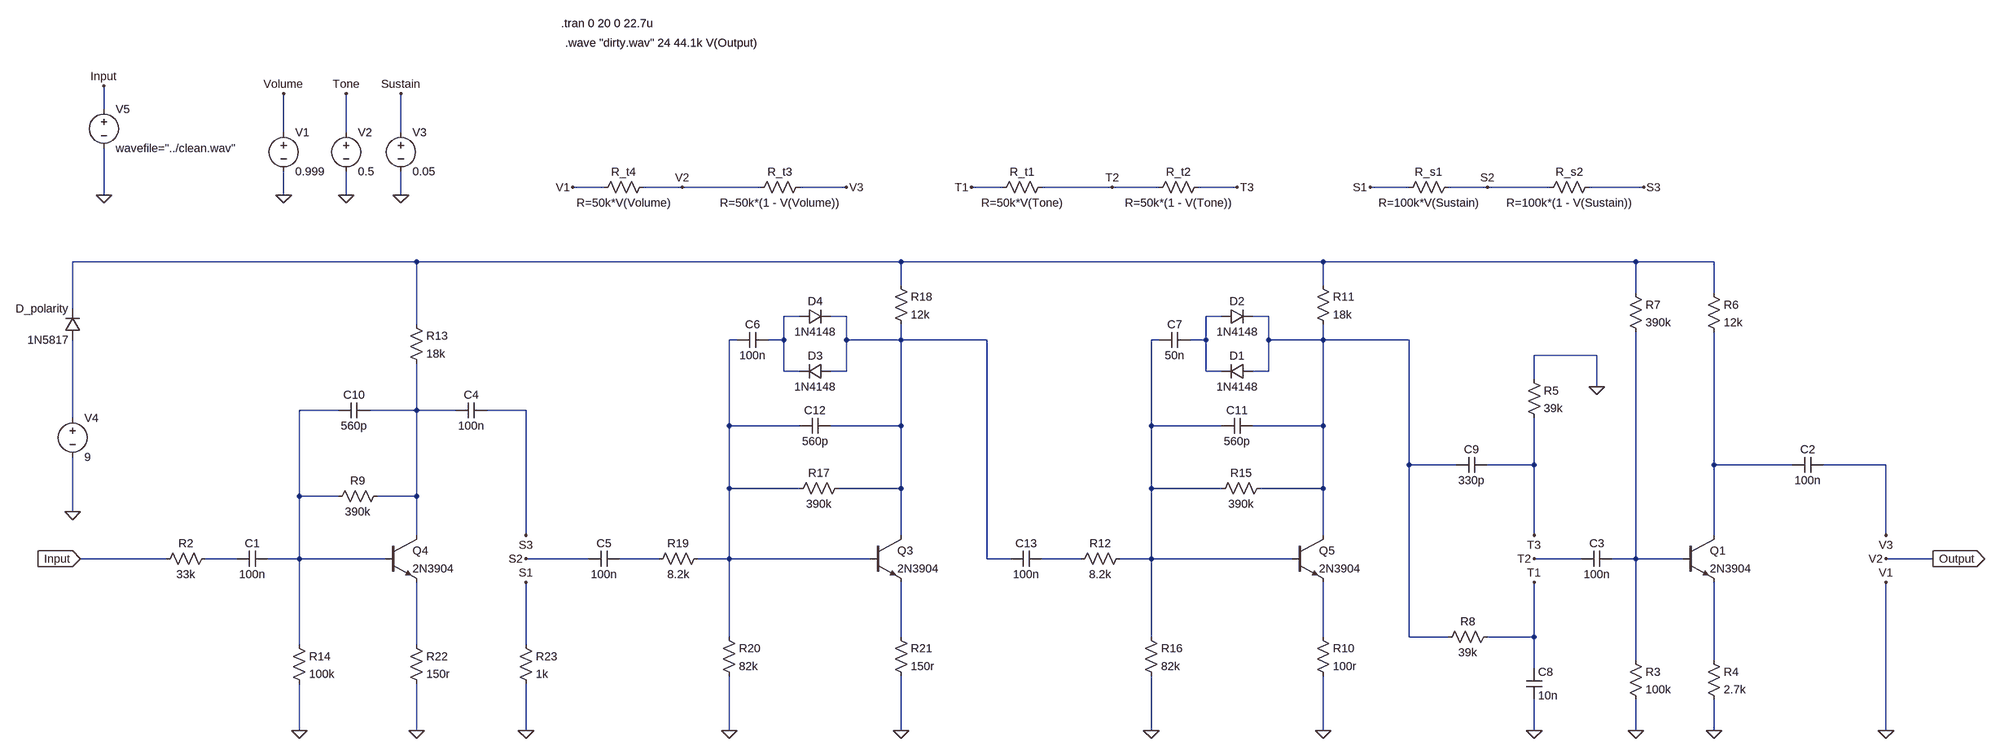
[diagram p0: schematic elk_sustainar.asc]
elk_sustainar.asc, the LTspice schematic file:
Version 4.1
SHEET 1 6764 4092
WIRE -464 -736 -464 -784
WIRE -96 -688 -96 -768
WIRE 32 -688 32 -768
WIRE 144 -688 144 -768
WIRE 560 -576 496 -576
WIRE 720 -576 640 -576
WIRE 880 -576 720 -576
WIRE 1056 -576 960 -576
WIRE 1376 -576 1312 -576
WIRE 1600 -576 1456 -576
WIRE 1696 -576 1600 -576
WIRE 1856 -576 1776 -576
WIRE 2208 -576 2128 -576
WIRE 2368 -576 2288 -576
WIRE 2496 -576 2368 -576
WIRE 2688 -576 2576 -576
WIRE -464 -560 -464 -656
WIRE -96 -560 -96 -608
WIRE 32 -560 32 -608
WIRE 144 -560 144 -608
WIRE 176 -400 -528 -400
WIRE 1168 -400 176 -400
WIRE 2032 -400 1168 -400
WIRE 2672 -400 2032 -400
WIRE 2832 -400 2672 -400
WIRE 1168 -352 1168 -400
WIRE 2032 -352 2032 -400
WIRE 2672 -336 2672 -400
WIRE 2832 -336 2832 -400
WIRE -528 -304 -528 -400
WIRE 960 -288 928 -288
WIRE 1056 -288 1024 -288
WIRE 1824 -288 1792 -288
WIRE 1920 -288 1888 -288
WIRE 176 -272 176 -400
WIRE 832 -240 816 -240
WIRE 928 -240 928 -288
WIRE 928 -240 896 -240
WIRE 1056 -240 1056 -288
WIRE 1168 -240 1168 -272
WIRE 1168 -240 1056 -240
WIRE 1344 -240 1168 -240
WIRE 1696 -240 1680 -240
WIRE 1792 -240 1792 -288
WIRE 1792 -240 1760 -240
WIRE 1920 -240 1920 -288
WIRE 2032 -240 2032 -272
WIRE 2032 -240 1920 -240
WIRE 2208 -240 2032 -240
WIRE 2592 -208 2464 -208
WIRE 928 -176 928 -240
WIRE 960 -176 928 -176
WIRE 1056 -176 1056 -240
WIRE 1056 -176 1024 -176
WIRE 1792 -176 1792 -240
WIRE 1824 -176 1792 -176
WIRE 1920 -176 1920 -240
WIRE 1920 -176 1888 -176
WIRE 2464 -160 2464 -208
WIRE 2592 -144 2592 -208
WIRE 16 -96 -64 -96
WIRE 176 -96 176 -192
WIRE 176 -96 80 -96
WIRE 256 -96 176 -96
WIRE 400 -96 320 -96
WIRE -528 -80 -528 -240
WIRE 816 -64 816 -240
WIRE 960 -64 816 -64
WIRE 1168 -64 1168 -240
WIRE 1168 -64 1024 -64
WIRE 1680 -64 1680 -240
WIRE 1824 -64 1680 -64
WIRE 2032 -64 2032 -240
WIRE 2032 -64 1888 -64
WIRE 2208 16 2208 -240
WIRE 2304 16 2208 16
WIRE 2464 16 2464 -80
WIRE 2464 16 2368 16
WIRE 2832 16 2832 -256
WIRE 2992 16 2832 16
WIRE 3184 16 3056 16
WIRE 816 64 816 -64
WIRE 960 64 816 64
WIRE 1168 64 1168 -64
WIRE 1168 64 1040 64
WIRE 1680 64 1680 -64
WIRE 1824 64 1680 64
WIRE 2032 64 2032 -64
WIRE 2032 64 1904 64
WIRE -64 80 -64 -96
WIRE 16 80 -64 80
WIRE 176 80 176 -96
WIRE 176 80 96 80
WIRE -528 112 -528 0
WIRE 176 160 176 80
WIRE 400 160 400 -96
WIRE 1168 160 1168 64
WIRE 2032 160 2032 64
WIRE 2464 160 2464 16
WIRE 2832 160 2832 16
WIRE 3184 160 3184 16
WIRE -336 208 -512 208
WIRE -192 208 -256 208
WIRE -64 208 -64 80
WIRE -64 208 -128 208
WIRE 112 208 -64 208
WIRE 528 208 400 208
WIRE 672 208 592 208
WIRE 816 208 816 64
WIRE 816 208 752 208
WIRE 1104 208 816 208
WIRE 1344 208 1344 -240
WIRE 1392 208 1344 208
WIRE 1536 208 1456 208
WIRE 1680 208 1680 64
WIRE 1680 208 1616 208
WIRE 1968 208 1680 208
WIRE 2560 208 2464 208
WIRE 2672 208 2672 -256
WIRE 2672 208 2624 208
WIRE 2768 208 2672 208
WIRE 3280 208 3184 208
WIRE 816 368 816 208
WIRE 1168 368 1168 256
WIRE 1680 368 1680 208
WIRE 2032 368 2032 256
WIRE 2208 368 2208 16
WIRE 2288 368 2208 368
WIRE 2464 368 2464 256
WIRE 2464 368 2368 368
WIRE -64 384 -64 208
WIRE 176 384 176 256
WIRE 400 384 400 256
WIRE 2672 416 2672 208
WIRE 2832 416 2832 256
WIRE 2464 432 2464 368
WIRE -64 560 -64 464
WIRE 176 560 176 464
WIRE 400 560 400 464
WIRE 816 560 816 448
WIRE 1168 560 1168 448
WIRE 1680 560 1680 448
WIRE 2032 560 2032 448
WIRE 2464 560 2464 496
WIRE 2672 560 2672 496
WIRE 2832 560 2832 496
WIRE 3184 560 3184 256
FLAG -96 -560 0
FLAG -96 -768 Volume
FLAG 32 -560 0
FLAG 32 -768 Tone
FLAG 144 -560 0
FLAG 144 -768 Sustain
FLAG -464 -784 Input
FLAG -464 -560 0
FLAG 1600 -576 T2
FLAG 2368 -576 S2
FLAG 2688 -576 S3
FLAG 2128 -576 S1
FLAG 1856 -576 T3
FLAG 1312 -576 T1
FLAG -528 112 0
FLAG -512 208 Input
IOPIN -512 208 In
FLAG 720 -576 V2
FLAG 1056 -576 V3
FLAG 496 -576 V1
FLAG -64 560 0
FLAG 176 560 0
FLAG 400 256 S1
FLAG 400 560 0
FLAG 400 160 S3
FLAG 400 208 S2
FLAG 816 560 0
FLAG 1168 560 0
FLAG 1680 560 0
FLAG 2032 560 0
FLAG 2464 560 0
FLAG 2592 -144 0
FLAG 2464 256 T1
FLAG 2464 160 T3
FLAG 2464 208 T2
FLAG 2672 560 0
FLAG 2832 560 0
FLAG 3184 256 V1
FLAG 3184 160 V3
FLAG 3184 208 V2
FLAG 3184 560 0
FLAG 3280 208 Output
IOPIN 3280 208 Out
SYMBOL voltage -96 -704 R0
WINDOW 123 0 0 Left 0
WINDOW 39 0 0 Left 0
SYMATTR InstName V1
SYMATTR Value 0.999
SYMBOL voltage 32 -704 R0
WINDOW 123 0 0 Left 0
WINDOW 39 0 0 Left 0
SYMATTR InstName V2
SYMATTR Value 0.5
SYMBOL voltage 144 -704 R0
WINDOW 123 0 0 Left 0
WINDOW 39 0 0 Left 0
SYMATTR InstName V3
SYMATTR Value 0.05
SYMBOL voltage -464 -752 R0
WINDOW 123 0 0 Left 0
WINDOW 39 0 0 Left 0
SYMATTR InstName V5
SYMATTR Value wavefile="../clean.wav"
SYMBOL res 1792 -592 R90
WINDOW 0 0 56 VBottom 2
WINDOW 3 32 56 VTop 2
SYMATTR InstName R_t2
SYMATTR Value R=50k*(1 - V(Tone))
SYMBOL res 1472 -592 R90
WINDOW 0 0 56 VBottom 2
WINDOW 3 32 56 VTop 2
SYMATTR InstName R_t1
SYMATTR Value R=50k*V(Tone)
SYMBOL res 2592 -592 R90
WINDOW 0 0 56 VBottom 2
WINDOW 3 32 56 VTop 2
SYMATTR InstName R_s2
SYMATTR Value R=100k*(1 - V(Sustain))
SYMBOL res 2304 -592 R90
WINDOW 0 0 56 VBottom 2
WINDOW 3 32 56 VTop 2
SYMATTR InstName R_s1
SYMATTR Value R=100k*V(Sustain)
SYMBOL voltage -528 -96 R0
WINDOW 123 0 0 Left 0
WINDOW 39 0 0 Left 0
SYMATTR InstName V4
SYMATTR Value 9
SYMBOL diode -512 -240 R180
WINDOW 0 24 64 Left 2
WINDOW 3 24 0 Left 2
SYMATTR InstName D_polarity
SYMATTR Value 1N5817
SYMBOL res -240 192 R90
WINDOW 0 0 56 VBottom 2
WINDOW 3 32 56 VTop 2
SYMATTR InstName R2
SYMATTR Value 33k
SYMBOL cap -128 192 R90
WINDOW 0 0 32 VBottom 2
WINDOW 3 32 32 VTop 2
SYMATTR InstName C1
SYMATTR Value 100n
SYMBOL res 976 -592 R90
WINDOW 0 0 56 VBottom 2
WINDOW 3 32 56 VTop 2
SYMATTR InstName R_t3
SYMATTR Value R=50k*(1 - V(Volume))
SYMBOL res 656 -592 R90
WINDOW 0 0 56 VBottom 2
WINDOW 3 32 56 VTop 2
SYMATTR InstName R_t4
SYMATTR Value R=50k*V(Volume)
SYMBOL npn 112 160 R0
SYMATTR InstName Q4
SYMATTR Value 2N3904
SYMBOL res -80 368 R0
SYMATTR InstName R14
SYMATTR Value 100k
SYMBOL res 160 368 R0
SYMATTR InstName R22
SYMATTR Value 150r
SYMBOL res 112 64 R90
WINDOW 0 0 56 VBottom 2
WINDOW 3 32 56 VTop 2
SYMATTR InstName R9
SYMATTR Value 390k
SYMBOL cap 80 -112 R90
WINDOW 0 0 32 VBottom 2
WINDOW 3 32 32 VTop 2
SYMATTR InstName C10
SYMATTR Value 560p
SYMBOL res 160 -288 R0
SYMATTR InstName R13
SYMATTR Value 18k
SYMBOL cap 320 -112 R90
WINDOW 0 0 32 VBottom 2
WINDOW 3 32 32 VTop 2
SYMATTR InstName C4
SYMATTR Value 100n
SYMBOL cap 592 192 R90
WINDOW 0 0 32 VBottom 2
WINDOW 3 32 32 VTop 2
SYMATTR InstName C5
SYMATTR Value 100n
SYMBOL res 384 368 R0
SYMATTR InstName R23
SYMATTR Value 1k
SYMBOL res 768 192 R90
WINDOW 0 0 56 VBottom 2
WINDOW 3 32 56 VTop 2
SYMATTR InstName R19
SYMATTR Value 8.2k
SYMBOL res 800 352 R0
SYMATTR InstName R20
SYMATTR Value 82k
SYMBOL npn 1104 160 R0
SYMATTR InstName Q3
SYMATTR Value 2N3904
SYMBOL res 1152 352 R0
SYMATTR InstName R21
SYMATTR Value 150r
SYMBOL res 1056 48 R90
WINDOW 0 0 56 VBottom 2
WINDOW 3 32 56 VTop 2
SYMATTR InstName R17
SYMATTR Value 390k
SYMBOL cap 1024 -80 R90
WINDOW 0 0 32 VBottom 2
WINDOW 3 32 32 VTop 2
SYMATTR InstName C12
SYMATTR Value 560p
SYMBOL cap 896 -256 R90
WINDOW 0 0 32 VBottom 2
WINDOW 3 32 32 VTop 2
SYMATTR InstName C6
SYMATTR Value 100n
SYMBOL diode 960 -304 M90
WINDOW 0 0 32 VBottom 2
WINDOW 3 32 32 VTop 2
SYMATTR InstName D4
SYMATTR Value 1N4148
SYMBOL diode 1024 -192 R90
WINDOW 0 0 32 VBottom 2
WINDOW 3 32 32 VTop 2
SYMATTR InstName D3
SYMATTR Value 1N4148
SYMBOL res 1152 -368 R0
SYMATTR InstName R18
SYMATTR Value 12k
SYMBOL cap 1456 192 R90
WINDOW 0 0 32 VBottom 2
WINDOW 3 32 32 VTop 2
SYMATTR InstName C13
SYMATTR Value 100n
SYMBOL res 1632 192 R90
WINDOW 0 0 56 VBottom 2
WINDOW 3 32 56 VTop 2
SYMATTR InstName R12
SYMATTR Value 8.2k
SYMBOL res 1664 352 R0
SYMATTR InstName R16
SYMATTR Value 82k
SYMBOL npn 1968 160 R0
SYMATTR InstName Q5
SYMATTR Value 2N3904
SYMBOL res 2016 352 R0
SYMATTR InstName R10
SYMATTR Value 100r
SYMBOL res 1920 48 R90
WINDOW 0 0 56 VBottom 2
WINDOW 3 32 56 VTop 2
SYMATTR InstName R15
SYMATTR Value 390k
SYMBOL cap 1888 -80 R90
WINDOW 0 0 32 VBottom 2
WINDOW 3 32 32 VTop 2
SYMATTR InstName C11
SYMATTR Value 560p
SYMBOL cap 1760 -256 R90
WINDOW 0 0 32 VBottom 2
WINDOW 3 32 32 VTop 2
SYMATTR InstName C7
SYMATTR Value 50n
SYMBOL diode 1824 -304 M90
WINDOW 0 0 32 VBottom 2
WINDOW 3 32 32 VTop 2
SYMATTR InstName D2
SYMATTR Value 1N4148
SYMBOL diode 1888 -192 R90
WINDOW 0 0 32 VBottom 2
WINDOW 3 32 32 VTop 2
SYMATTR InstName D1
SYMATTR Value 1N4148
SYMBOL res 2016 -368 R0
SYMATTR InstName R11
SYMATTR Value 18k
SYMBOL cap 2368 0 R90
WINDOW 0 0 32 VBottom 2
WINDOW 3 32 32 VTop 2
SYMATTR InstName C9
SYMATTR Value 330p
SYMBOL res 2384 352 R90
WINDOW 0 0 56 VBottom 2
WINDOW 3 32 56 VTop 2
SYMATTR InstName R8
SYMATTR Value 39k
SYMBOL cap 2448 432 R0
SYMATTR InstName C8
SYMATTR Value 10n
SYMBOL res 2448 -176 R0
SYMATTR InstName R5
SYMATTR Value 39k
SYMBOL cap 2624 192 R90
WINDOW 0 0 32 VBottom 2
WINDOW 3 32 32 VTop 2
SYMATTR InstName C3
SYMATTR Value 100n
SYMBOL res 2656 400 R0
SYMATTR InstName R3
SYMATTR Value 100k
SYMBOL res 2656 -352 R0
SYMATTR InstName R7
SYMATTR Value 390k
SYMBOL npn 2768 160 R0
SYMATTR InstName Q1
SYMATTR Value 2N3904
SYMBOL res 2816 -352 R0
SYMATTR InstName R6
SYMATTR Value 12k
SYMBOL res 2816 400 R0
SYMATTR InstName R4
SYMATTR Value 2.7k
SYMBOL cap 3056 0 R90
WINDOW 0 0 32 VBottom 2
WINDOW 3 32 32 VTop 2
SYMATTR InstName C2
SYMATTR Value 100n
TEXT 472 -912 Left 2 !.tran 0 20 0 22.7u
TEXT 480 -872 Left 2 !.wave "dirty.wav" 24 44.1k V(Output)

The netlist it stands for:
* elk_sustainar.asc
V1 Volume 0 0.999
V2 Tone 0 0.5
V3 Sustain 0 0.05
V5 Input 0 wavefile="../clean.wav"
R_t2 T3 T2 R=50k*(1 - V(Tone))
R_t1 T2 T1 R=50k*V(Tone)
R_s2 S3 S2 R=100k*(1 - V(Sustain))
R_s1 S2 S1 R=100k*V(Sustain)
V4 N010 0 9
D_polarity N010 N001 1N5817
R2 N012 Input 33k
C1 N008 N012 100n
R_t3 V3 Output R=50k*(1 - V(Volume))
R_t4 Output 0 R=50k*V(Volume)
Q4 N009 N008 N018 0 2N3904
R14 N008 0 100k
R22 N018 0 150r
R9 N009 N008 390k
C10 N009 N008 560p
R13 N001 N009 18k
C4 S3 N009 100n
C5 N013 S2 100n
R23 S1 0 1k
R19 N006 N013 8.2k
R20 N006 0 82k
Q3 N003 N006 N016 0 2N3904
R21 N016 0 150r
R17 N003 N006 390k
C12 N003 N006 560p
C6 N002 N006 100n
D4 N002 N003 1N4148
D3 N003 N002 1N4148
R18 N001 N003 12k
C13 N014 N003 100n
R12 N007 N014 8.2k
R16 N007 0 82k
Q5 N005 N007 N017 0 2N3904
R10 N017 0 100r
R15 N005 N007 390k
C11 N005 N007 560p
C7 N004 N007 50n
D2 N004 N005 1N4148
D1 N005 N004 1N4148
R11 N001 N005 18k
C9 T3 N005 330p
R8 T1 N005 39k
C8 T1 0 10n
R5 0 T3 39k
C3 N015 T2 100n
R3 N015 0 100k
R7 N001 N015 390k
Q1 N011 N015 N019 0 2N3904
R6 N001 N011 12k
R4 N019 0 2.7k
C2 V3 N011 100n
.model D D
.lib standard.dio
.model NPN NPN
.model PNP PNP
.lib standard.bjt
.tran 0 20 0 22.7u
.wave "dirty.wav" 24 44.1k V(Output)
.backanno
.end